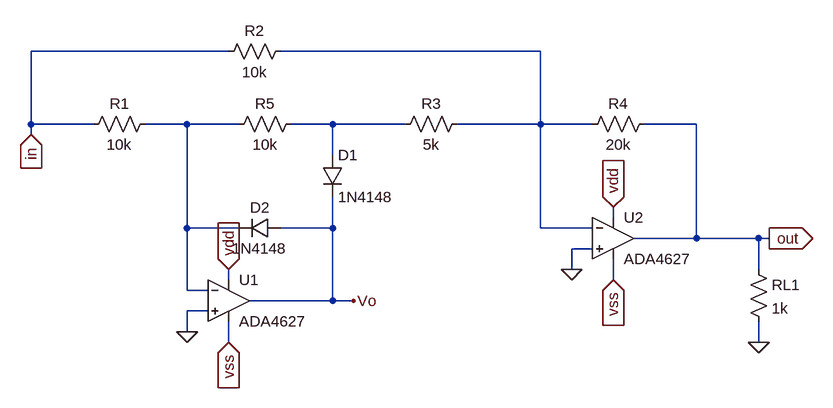
[diagram p0: schematic etj4.asc]
etj4.asc, the LTspice schematic file:
Version 4
SHEET 1 1184 680
WIRE 256 48 -48 48
WIRE 736 48 336 48
WIRE -48 160 -48 48
WIRE 48 160 -48 160
WIRE 192 160 128 160
WIRE 272 160 192 160
WIRE 416 160 352 160
WIRE 528 160 416 160
WIRE 736 160 736 48
WIRE 736 160 608 160
WIRE 816 160 736 160
WIRE 976 160 896 160
WIRE -48 176 -48 160
WIRE 416 208 416 160
WIRE 848 304 848 288
WIRE 192 320 192 160
WIRE 272 320 192 320
WIRE 416 320 416 272
WIRE 416 320 336 320
WIRE 736 320 736 160
WIRE 816 320 736 320
WIRE 976 336 976 160
WIRE 976 336 880 336
WIRE 1072 336 976 336
WIRE 1088 336 1072 336
WIRE 816 352 784 352
WIRE 784 384 784 352
WIRE 1072 384 1072 336
WIRE 256 400 256 384
WIRE 848 400 848 368
WIRE 192 416 192 320
WIRE 224 416 192 416
WIRE 416 432 416 320
WIRE 416 432 288 432
WIRE 448 432 416 432
WIRE 224 448 192 448
WIRE 192 480 192 448
WIRE 256 496 256 464
WIRE 1072 496 1072 464
FLAG 1072 496 0
FLAG 192 480 0
FLAG 448 432 Vo
FLAG 784 384 0
FLAG -48 176 in
IOPIN -48 176 In
FLAG 1088 336 out
IOPIN 1088 336 Out
FLAG 848 288 vdd
IOPIN 848 288 In
FLAG 256 384 vdd
IOPIN 256 384 In
FLAG 256 496 vss
IOPIN 256 496 In
FLAG 848 400 vss
IOPIN 848 400 In
SYMBOL res 1056 368 R0
SYMATTR InstName RL1
SYMATTR Value 1k
SYMBOL res 144 144 R90
WINDOW 0 0 56 VBottom 2
WINDOW 3 32 56 VTop 2
SYMATTR InstName R1
SYMATTR Value 10k
SYMBOL res 352 32 R90
WINDOW 0 0 56 VBottom 2
WINDOW 3 32 56 VTop 2
SYMATTR InstName R2
SYMATTR Value 10k
SYMBOL res 624 144 R90
WINDOW 0 0 56 VBottom 2
WINDOW 3 32 56 VTop 2
SYMATTR InstName R3
SYMATTR Value 5k
SYMBOL res 912 144 R90
WINDOW 0 0 56 VBottom 2
WINDOW 3 32 56 VTop 2
SYMATTR InstName R4
SYMATTR Value 20k
SYMBOL res 368 144 R90
WINDOW 0 0 56 VBottom 2
WINDOW 3 32 56 VTop 2
SYMATTR InstName R5
SYMATTR Value 10k
SYMBOL diode 400 208 R0
SYMATTR InstName D1
SYMATTR Value 1N4148
SYMBOL diode 336 304 R90
WINDOW 0 0 32 VBottom 2
WINDOW 3 32 32 VTop 2
SYMATTR InstName D2
SYMATTR Value 1N4148
SYMBOL OpAmps\\ADA4627 256 368 R0
SYMATTR InstName U1
SYMBOL OpAmps\\ADA4627 848 272 R0
SYMATTR InstName U2

The netlist it stands for:
* etj4.asc
RL1 out 0 1k
R1 N002 in 10k
R2 N001 in 10k
R3 N001 N003 5k
R4 out N001 20k
R5 N003 N002 10k
D1 N003 Vo 1N4148
D2 Vo N002 1N4148
XU1 0 N002 vdd vss Vo ADA4627  ; pins In+ In- V+ V- OUT
XU2 0 N001 vdd vss out ADA4627  ; pins In+ In- V+ V- OUT
.model D D
.lib standard.dio
.backanno
.end